# EAGLE design MainController (EAGLE 9.6.2)
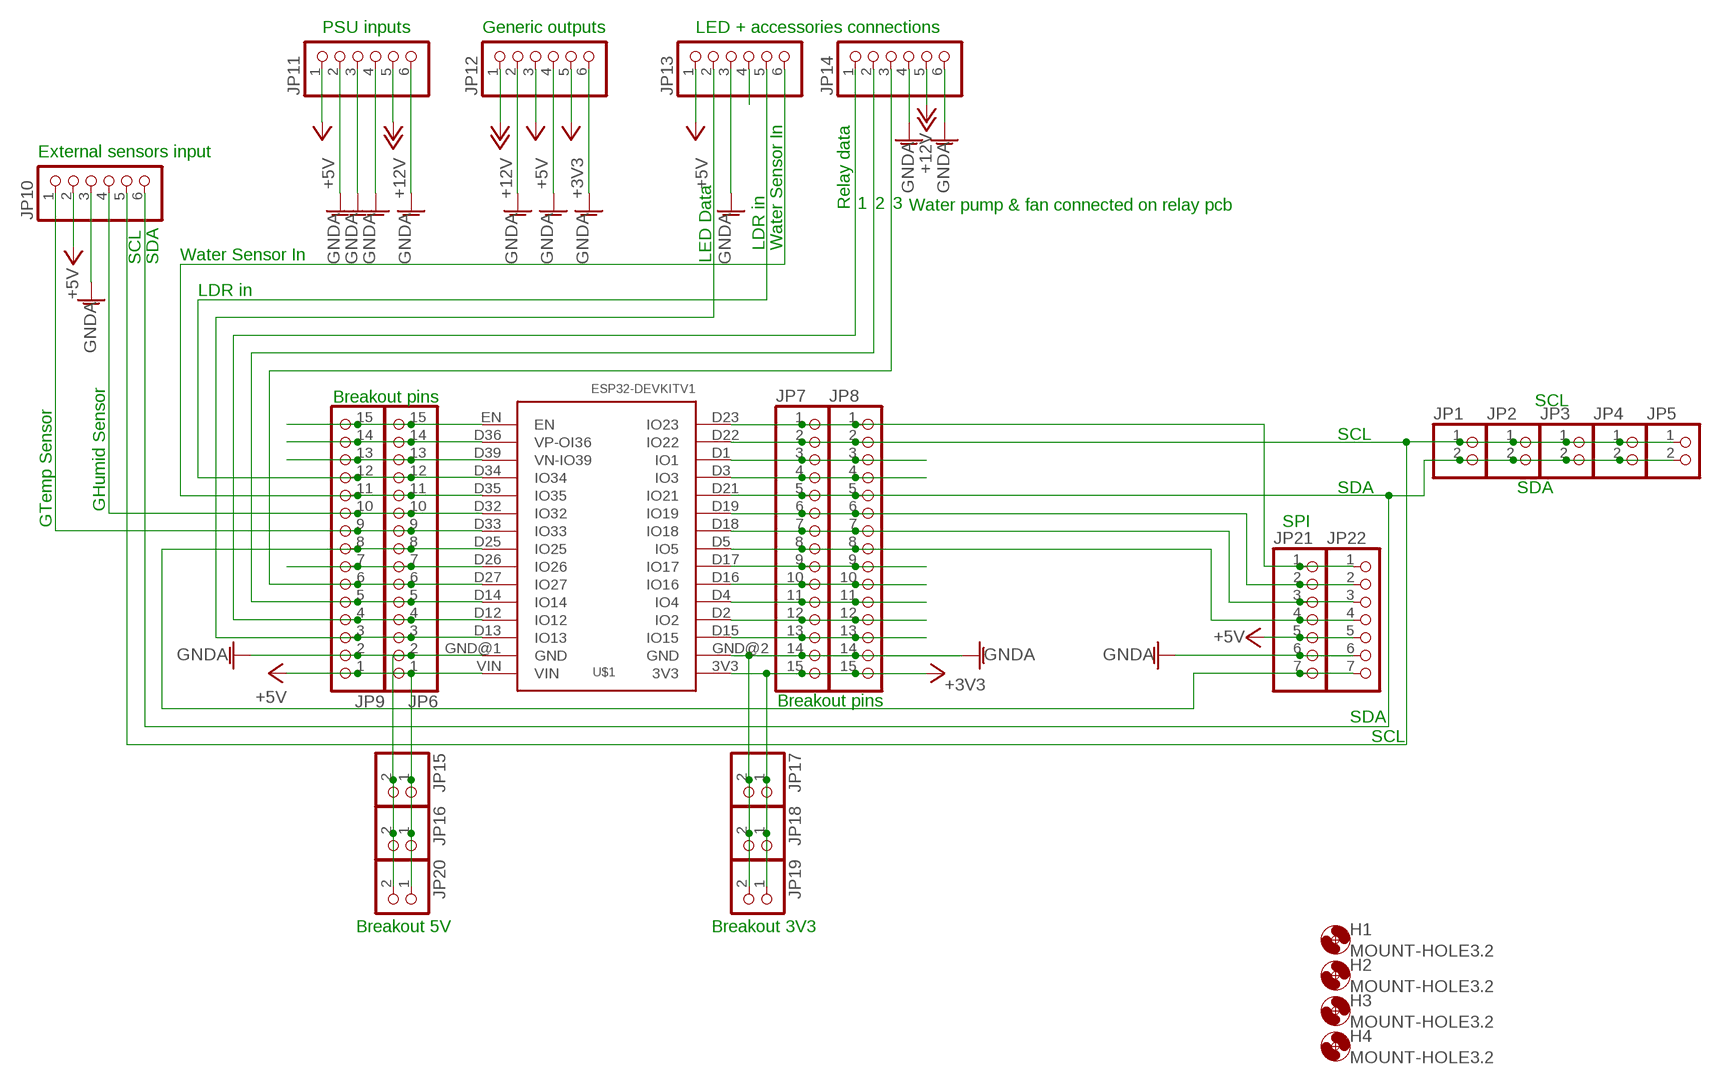
[diagram p0: schematic, sheet 1]

## Parts
H1  MOUNT-HOLE3.2  [3,2]
H2  MOUNT-HOLE3.2  [3,2]
H3  MOUNT-HOLE3.2  [3,2]
H4  MOUNT-HOLE3.2  [3,2]
JP1  PINHD-1X2  [1X02]
JP2  PINHD-1X2  [1X02]
JP3  PINHD-1X2  [1X02]
JP4  PINHD-1X2  [1X02]
JP5  PINHD-1X2  [1X02]
JP6  PINHD-1X15  [1X15]
JP7  PINHD-1X15  [1X15]
JP8  PINHD-1X15  [1X15]
JP9  PINHD-1X15  [1X15]
JP10  PINHD-1X6  [1X06]
JP11  PINHD-1X6  [1X06]
JP12  PINHD-1X6  [1X06]
JP13  PINHD-1X6  [1X06]
JP14  PINHD-1X6  [1X06]
JP15  PINHD-1X2  [1X02]
JP16  PINHD-1X2  [1X02]
JP17  PINHD-1X2  [1X02]
JP18  PINHD-1X2  [1X02]
JP19  PINHD-1X2  [1X02]
JP20  PINHD-1X2  [1X02]
JP21  PINHD-1X7  [1X07]
JP22  PINHD-1X7  [1X07]
U$1  ESP32DEVKITV1  [ESP32-DEVKITV1]

## Nets
+3V3: JP7.15 JP8.15 JP12.5 JP17.1 JP18.1 JP19.1 U$1.3V3
+5V: JP6.1 JP9.1 JP10.2 JP11.1 JP12.3 JP13.1 JP15.1 JP16.1 JP20.1 JP21.5 JP22.5 U$1.VIN
+12V: JP11.5 JP12.1 JP14.5
GNDA: JP6.2 JP7.14 JP8.14 JP9.2 JP10.3 JP11.2 JP11.3 JP11.4 JP11.6 JP12.2 JP12.4 JP12.6 JP13.3 JP14.4 JP14.6 JP15.2 JP16.2 JP17.2 JP18.2 JP19.2 JP20.2 JP21.6 JP22.6 U$1.GND@1(GND) U$1.GND@2(GND)
N$1: JP6.10 JP9.10 JP10.4 U$1.D32(IO32)
N$2: JP6.9 JP9.9 JP10.1 U$1.D33(IO33)
N$3: JP7.9 JP8.9 U$1.D17(IO17)
N$4: JP6.7 JP9.7 U$1.D26(IO26)
N$6: JP7.6 JP8.6 JP21.2 JP22.2 U$1.D19(IO19)
N$7: JP7.1 JP8.1 JP21.1 JP22.1 U$1.D23(IO23)
N$8: JP6.13 JP9.13 U$1.D39(VN-IO39)
N$9: JP6.14 JP9.14 U$1.D36(VP-OI36)
N$10: JP6.15 JP9.15 U$1.EN
N$14: JP1.1 JP2.1 JP3.1 JP4.1 JP5.1 JP7.2 JP8.2 JP10.5 U$1.D22(IO22)
N$15: JP13.4
N$16: JP6.3 JP9.3 JP13.2 U$1.D13(IO13)
N$17: JP6.12 JP9.12 JP13.5 U$1.D34(IO34)
N$18: JP7.3 JP8.3 U$1.D1(IO1)
N$19: JP7.4 JP8.4 U$1.D3(IO3)
N$20: JP1.2 JP2.2 JP3.2 JP4.2 JP5.2 JP7.5 JP8.5 JP10.6 U$1.D21(IO21)
N$21: JP6.4 JP9.4 JP14.1 U$1.D12(IO12)
N$22: JP6.5 JP9.5 JP14.2 U$1.D14(IO14)
N$23: JP7.8 JP8.8 JP21.4 JP22.4 U$1.D5(IO5)
N$24: JP7.10 JP8.10 U$1.D16(IO16)
N$26: JP7.11 JP8.11 U$1.D4(IO4)
N$27: JP7.12 JP8.12 U$1.D2(IO2)
N$28: JP7.13 JP8.13 U$1.D15(IO15)
N$29: JP6.11 JP9.11 JP13.6 U$1.D35(IO35)
N$34: JP6.8 JP9.8 JP21.7 JP22.7 U$1.D25(IO25)
N$35: JP7.7 JP8.7 JP21.3 JP22.3 U$1.D18(IO18)
N$36: JP6.6 JP9.6 JP14.3 U$1.D27(IO27)

## Notes on the sheet
- PSU inputs | Generic outputs | LED + accessories connections
- External sensors input
- Relay data | 1 | 2 | 3 | Water pump & fan connected on relay pcb
- LDR in | Water Sensor In
- SCL | SDA | Water Sensor In | LED Data
- LDR in
- Breakout pins | SCL
- SCL
- SDA | SDA
- GHumid Sensor
- GTemp Sensor | SPI
- Breakout pins
- SDA
- SCL
- Breakout 5V | Breakout 3V3

## Library data of the parts
H1-H4 = holes:MOUNT-HOLE: MOUNTING HOLE with drill center marker
JP1-JP5 JP15-JP20 = pinhead:PINHD-1X2: PIN HEADER
JP6-JP9 = pinhead:PINHD-1X15: PIN HEADER
JP10-JP14 = pinhead:PINHD-1X6: PIN HEADER
JP21 JP22 = pinhead:PINHD-1X7: PIN HEADER
U$1 = ESP32-DEVKITV1:ESP32DEVKITV1

## Board
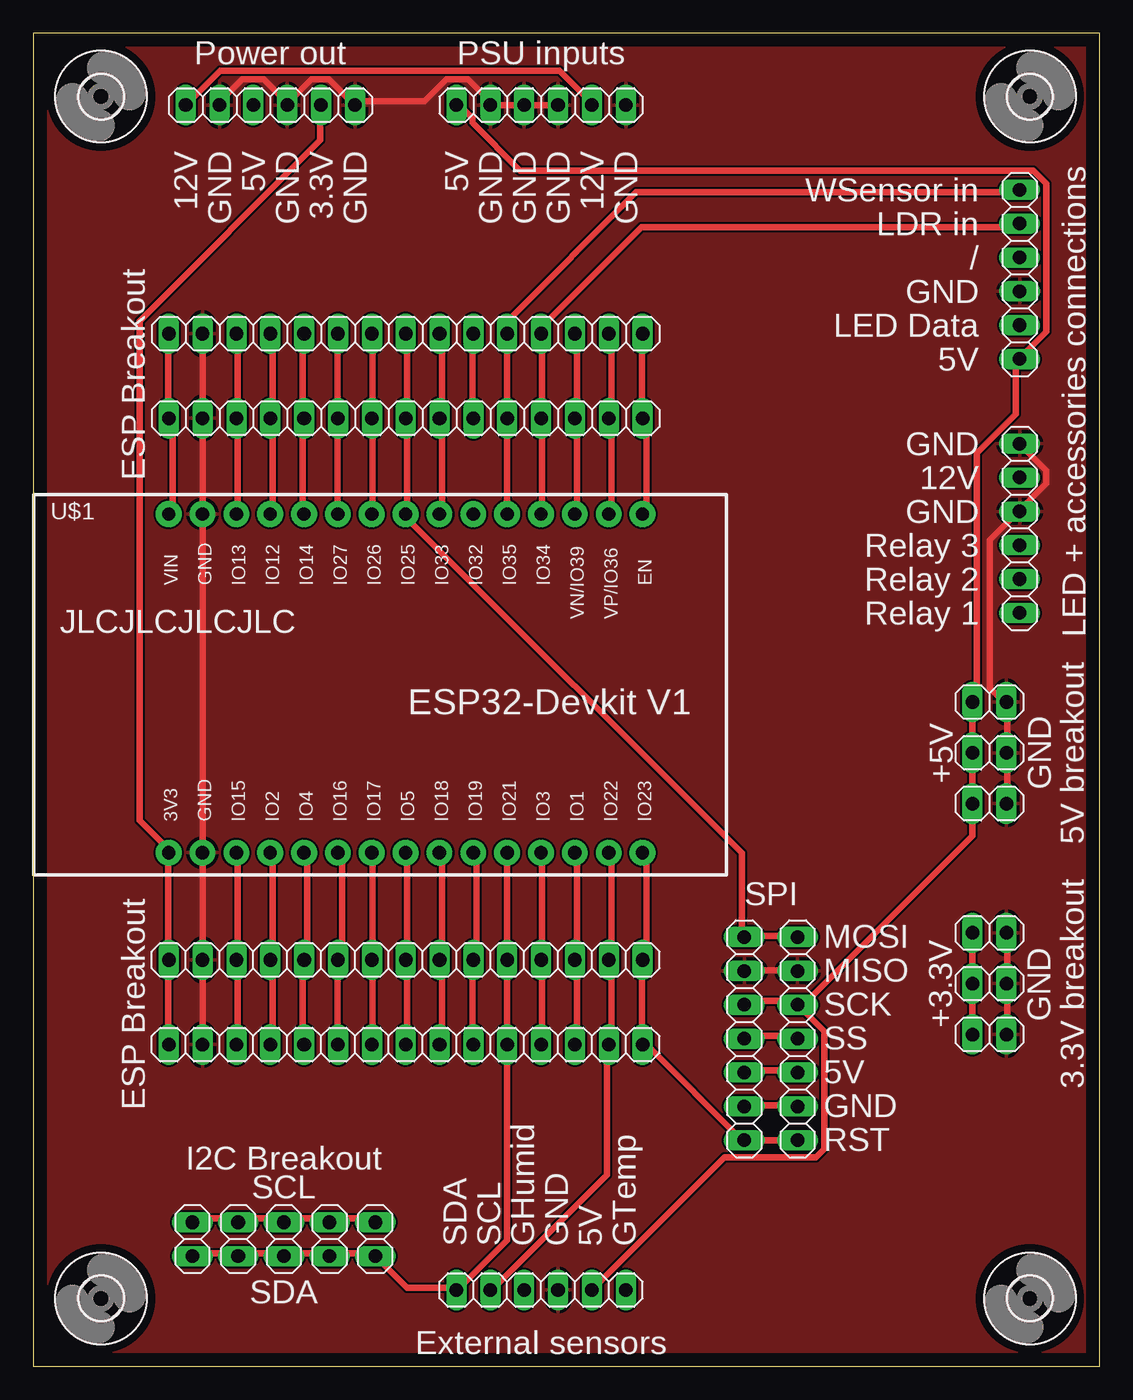
[diagram p1: board, top side]
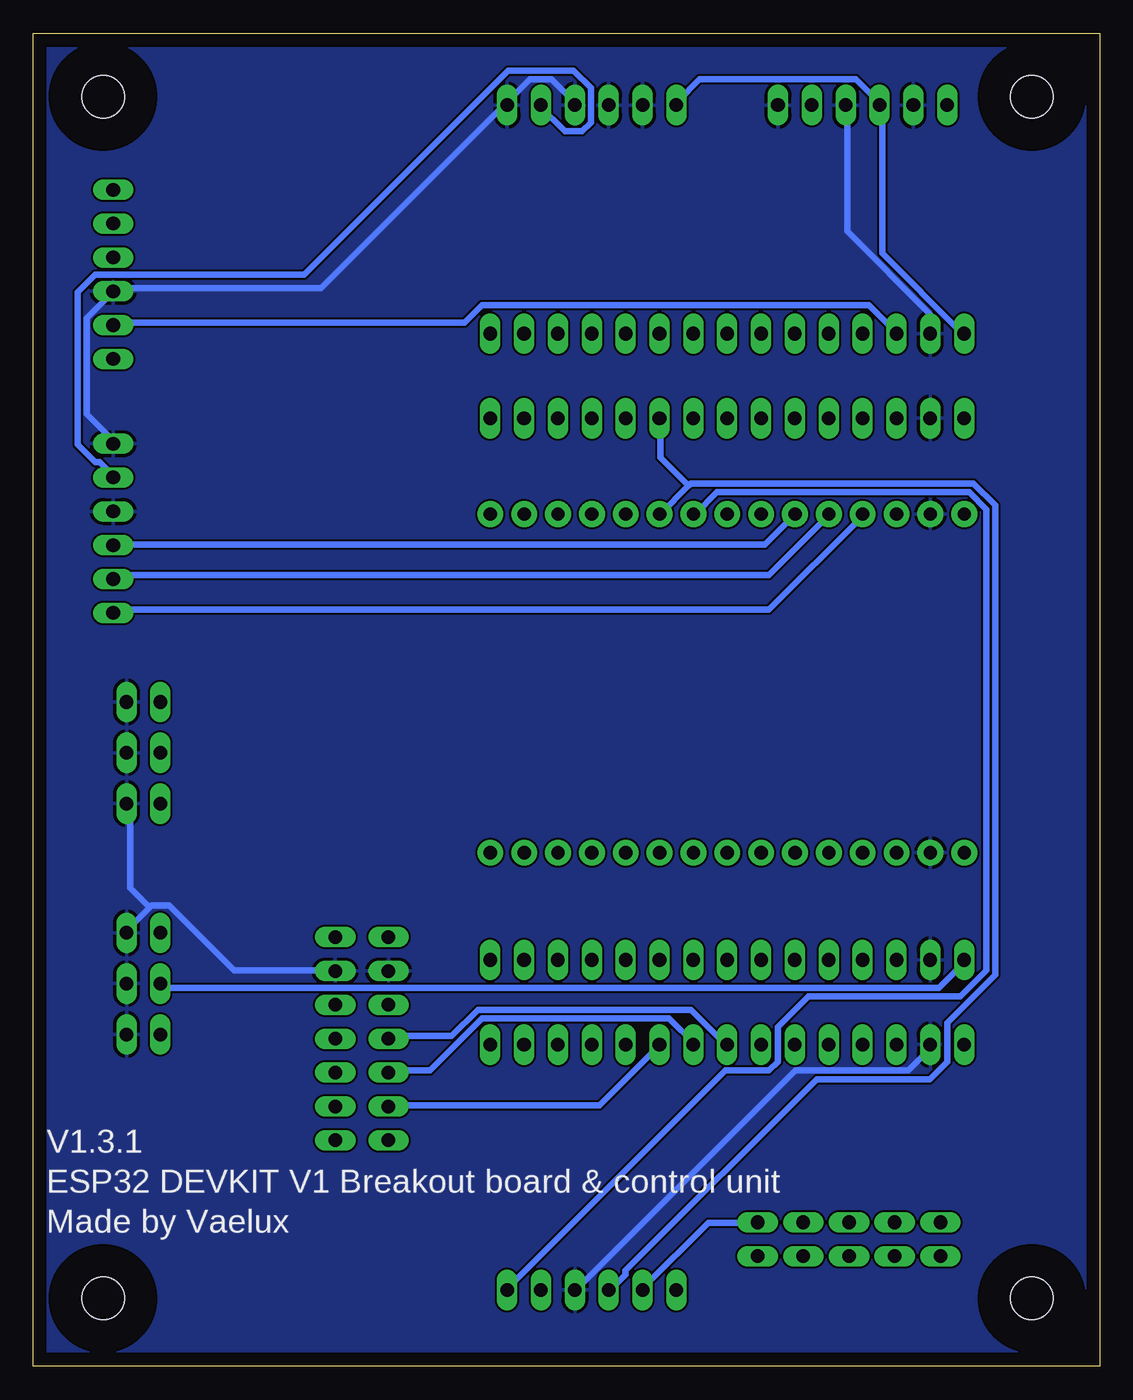
[diagram p2: board, bottom side, seen from below]

Size 80 x 100 mm. Coordinates in mm from the lower left corner, seen from the top.
Outline: 0,0 80,0 80,100 0,100 0,0
Copper layers (1*16): Top 0.035mm / dielectric 1.5mm / Bottom 0.035mm
Design rules "default *": minimum track width 0.5mm, minimum drill 0.35mm, track to track 6mil, track to pad 6mil, pad to pad 6mil, via to via 6mil, smd to smd 6mil, copper to edge 40mil, drill to drill 6mil, minimum pad ring 10mil, minimum via ring 8mil, stop-mask expansion 4mil, vias tented up to drill 0mil, thermal gap 10mil

### Footprints (pad centres in the part's own frame; a part is rotated, then mirrored left to right if it is on the bottom)
3,2 = hole 3.2: 0,0
1X02 = drill 1.016 long: 1 -1.27,0; 2 1.27,0
1X15 = drill 1.016 long: 1 -17.78,0; 2 -15.24,0; 3 -12.7,0; 4 -10.16,0; 5 -7.62,0; 6 -5.08,0; 7 -2.54,0; 8 0,0; 9 2.54,0; 10 5.08,0; 11 7.62,0; 12 10.16,0; 13 12.7,0; 14 15.24,0; 15 17.78,0
1X06 = drill 1.016 long: 1 -6.35,0; 2 -3.81,0; 3 -1.27,0; 4 1.27,0; 5 3.81,0; 6 6.35,0
1X07 = drill 1.016 long: 1 -7.62,0; 2 -5.08,0; 3 -2.54,0; 4 0,0; 5 2.54,0; 6 5.08,0; 7 7.62,0
ESP32-DEVKITV1 = drill 1 pad 1.93: 3V3 -16.52,-12.27; D1 13.96,-12.27; D2 -8.9,-12.27; D3 11.42,-12.27; D4 -6.36,-12.27; D5 1.26,-12.27; D12 -8.9,13.135; D13 -11.44,13.135; D14 -6.36,13.135; D15 -11.44,-12.27; D16 -3.82,-12.27; D17 -1.28,-12.27; D18 3.8,-12.27; D19 6.34,-12.27; D21 8.88,-12.27; D22 16.5,-12.27; D23 19.04,-12.27; D25 1.26,13.135; D26 -1.28,13.135; D27 -3.82,13.135; D32 6.34,13.135; D33 3.8,13.135; D34 11.42,13.135; D35 8.88,13.135; D36 16.5,13.135; D39 13.96,13.135; EN 19.04,13.135; GND@1 -13.98,13.135; GND@2 -13.98,-12.27; VIN -16.52,13.135

### Placement (x,y rotation side)
H1  5.08,5.08 0 top
H2  5.08,95.25 0 top
H3  74.77,5.08 0 top
H4  74.77,95.25 0 top
JP1  11.94,9.53 270 top
JP2  15.37,9.53 270 top
JP3  18.8,9.53 270 top
JP4  22.23,9.53 270 top
JP5  25.65,9.53 270 top
JP6  27.94,71.12 0 top
JP7  27.94,30.48 180 top
JP8  27.94,24.13 180 top
JP9  27.94,77.47 0 top
JP10  38.1,5.71 180 top
JP11  38.1,94.61 0 top
JP12  17.78,94.61 0 top
JP13  74.01,81.92 90 top
JP14  74.01,62.87 90 top
JP15  71.74,42.21 0 top
JP16  71.74,46.02 0 top
JP17  71.74,24.89 0 top
JP18  71.74,28.7 0 top
JP19  71.74,32.51 0 top
JP20  71.74,49.83 0 top
JP21  53.35,24.57 90 top
JP22  57.35,24.57 90 top
U$1  26.67,50.8 0 top

### Tracks (layer width: path | path; a pad name or v marks a point on that pad's centre or on a via)
+3V3
  Top 0.5: JP17.1 70.46,25.12 70.46,28.38 JP18.1 70.46,32.29 JP19.1 | JP8.15 10.11,24.14 10.11,30.34 JP7.15 10.11,30.66 10.11,38.49 U$1.3V3 10.11,38.82 7.97,40.96 7.97,78.42 21.53,91.97 21.53,94.6 JP12.5
  Bottom 0.5: JP18.1 70.46,28.38 12.07,28.38 10.11,30.34 JP7.15
+5V
  Top 0.5: JP9.1 10.11,77.31 10.11,71.44 JP6.1 10.44,71.11 10.44,63.94 U$1.VIN | JP10.2 42.08,5.87 51.87,15.66 58.72,15.66 59.37,16.31 59.37,25.12 57.41,27.07 JP22.5 | JP21.5 53.5,27.4 57.09,27.4 JP22.5 | JP22.5 57.74,27.07 70.46,39.8 70.46,42.08 JP15.1 70.46,42.41 70.46,45.99 JP16.1 70.46,46.32 70.46,49.58 JP20.1 70.78,49.91 70.78,68.5 73.72,71.44 73.72,75.35 JP13.1 74.05,75.68 76,77.64 76,88.73 75.03,89.7 36.53,89.7 32.95,93.29 32.95,93.62 31.97,94.6 JP11.1
  Bottom 0.5: JP11.1 31.64,94.92 30.01,96.56 18.27,96.56 16.64,94.92 JP12.3 16.31,94.6 16.31,83.51 10.44,77.64 JP9.1
+12V
  Top 0.5: JP12.1 11.74,94.92 14.03,97.21 39.47,97.21 41.75,94.92 JP11.5
  Bottom 0.5: JP14.5 74.05,66.87 75.03,67.85 75.35,67.85 76.66,69.15 76.66,80.57 75.35,81.88 59.7,81.88 44.36,97.21 39.47,97.21 38.16,95.9 38.16,93.29 38.82,92.64 40.12,92.64 42.08,94.6 JP11.5
GNDA
  Top 0.5: JP14.6 74.05,69.15 76,67.2 76,66.22 74.05,64.26 JP14.4 73.72,63.94 71.76,61.98 71.76,50.89 72.74,49.91 JP20.2 73.07,49.58 73.07,46.32 JP16.2 73.07,45.99 73.07,42.41 JP15.2 | JP21.6 53.5,29.68 57.09,29.68 JP22.6 | JP17.2 73.07,25.12 73.07,28.38 JP18.2 73.07,28.71 73.07,32.29 JP19.2 | JP8.14 12.72,24.14 12.72,30.34 JP7.14 12.72,30.66 12.72,38.49 U$1.GND@2 12.72,38.82 12.72,63.61 U$1.GND@1 12.72,63.94 12.72,71.11 JP6.2 12.72,71.44 12.72,77.31 JP9.2 | JP12.2 14.03,94.92 15.66,96.56 17.29,96.56 18.92,94.92 JP12.4 19.25,94.92 20.88,96.56 22.18,96.56 23.81,94.92 JP12.6 24.14,94.92 29.36,94.92 30.99,96.56 32.62,96.56 34.25,94.92 JP11.2 34.58,94.6 36.53,94.6 JP11.3 36.86,94.6 39.14,94.6 JP11.4
  Bottom 0.5: JP14.6 74.05,69.48 76,71.44 76,78.61 74.05,80.57 JP13.3 73.72,80.9 58.39,80.9 44.69,94.6 JP11.6 44.36,94.92 42.73,96.56 41.1,96.56 39.47,94.92 JP11.4 | 71.28,34.41 73.07,32.62 JP19.2 | 71.28,34.41 71.11,34.58 69.81,34.58 64.91,29.68 57.41,29.68 JP22.6 | 71.28,34.41 72.74,35.88 72.74,42.08 JP15.2 | JP10.3 39.14,5.87 22.83,22.18 14.35,22.18 12.72,23.81 JP8.14 | JP9.2 12.72,77.64 12.72,78.94 18.92,85.14 18.92,94.6 JP12.4
  pour Top: 0,100 79,100 80,100 80,0 0,0
  pour Bottom: 0,100 80,100 80,0 0,0
N$1
  Top 0.5: JP6.10 32.95,71.44 32.95,77.31 JP9.10
  Bottom 0.5: 30.83,66.06 32.95,63.94 U$1.D32 | 30.83,66.06 30.66,66.22 9.46,66.22 7.83,64.59 7.83,29.36 11.42,25.77 11.42,22.83 12.72,21.53 21.2,21.53 35.56,7.18 35.56,6.85 36.53,5.87 JP10.4 | 30.83,66.06 32.95,68.18 32.95,71.11 JP6.10
N$2
  Top 0.5: JP9.9 30.66,77.31 30.66,71.44 JP6.9 30.66,71.11 30.66,63.94 U$1.D33
  Bottom 0.5: JP10.1 44.36,5.87 28.05,22.18 24.79,22.18 24.14,22.83 24.14,25.44 21.86,27.73 10.44,27.73 8.48,29.68 8.48,64.26 9.79,65.57 28.71,65.57 30.34,63.94 U$1.D33
N$3
  Top 0.5: JP8.9 25.44,24.14 25.44,30.34 JP7.9 25.44,30.66 25.44,38.49 U$1.D17
N$4
  Top 0.5: JP9.7 25.44,77.31 25.44,71.44 JP6.7 25.44,71.11 25.44,63.94 U$1.D26
N$6
  Top 0.5: JP21.2 53.5,19.57 57.09,19.57 JP22.2 | JP8.6 32.95,24.14 32.95,30.34 JP7.6 33.27,30.66 33.27,38.49 U$1.D19
  Bottom 0.5: JP21.2 53.17,19.57 37.51,19.57 33.27,23.81 JP8.6
N$7
  Top 0.5: JP22.1 57.09,16.96 53.5,16.96 JP21.1 53.17,16.96 45.99,24.14 JP8.1 45.67,24.14 45.67,30.34 JP7.1 45.99,30.66 45.99,38.49 U$1.D23
N$8
  Top 0.5: JP9.13 40.77,77.31 40.77,71.44 JP6.13 40.77,71.11 40.77,63.94 U$1.D39
N$9
  Top 0.5: JP9.14 43.38,77.31 43.38,71.44 JP6.14 43.38,71.11 43.38,63.94 U$1.D36
N$10
  Top 0.5: JP9.15 45.67,77.31 45.67,71.44 JP6.15 45.99,71.11 45.99,63.94 U$1.EN
N$14
  Top 0.5: U$1.D22 43.38,38.49 43.38,30.66 JP7.2 43.38,30.34 43.38,24.14 JP8.2 43.06,23.81 43.06,14.35 34.58,5.87 JP10.5 | JP1.1 12.07,11.09 15.33,11.09 JP2.1 15.66,11.09 18.59,11.09 JP3.1 18.92,11.09 22.18,11.09 JP4.1 22.51,11.09 25.44,11.09 JP5.1
  Bottom 0.5: JP10.5 34.25,5.87 29.36,10.77 25.77,10.77 JP5.1
N$16
  Top 0.5: JP9.3 15.33,77.31 15.33,71.44 JP6.3 15.33,71.11 15.33,63.94 U$1.D13
  Bottom 0.5: JP13.2 73.72,78.29 47.62,78.29 46.32,79.59 17.29,79.59 15.33,77.64 JP9.3
N$17
  Top 0.5: JP13.5 73.72,85.46 45.61,85.46 38.41,78.27 JP9.12 38.16,77.31 38.16,71.44 JP6.12 38.16,71.11 38.16,63.94 U$1.D34
N$18
  Top 0.5: JP8.3 40.77,24.14 40.77,30.34 JP7.3 40.77,30.66 40.77,38.49 U$1.D1
N$19
  Top 0.5: JP8.4 38.16,24.14 38.16,30.34 JP7.4 38.16,30.66 38.16,38.49 U$1.D3
N$20
  Top 0.5: U$1.D21 35.56,38.49 35.56,30.66 JP7.5 35.56,30.34 JP8.5 35.56,23.81 35.56,9.46 31.97,5.87 JP10.6 31.64,5.87 28.05,5.87 25.77,8.15 JP5.2 25.44,8.48 22.51,8.48 JP4.2 22.18,8.48 18.92,8.48 JP3.2 18.59,8.48 15.66,8.48 JP2.2 15.33,8.48 12.07,8.48 JP1.2
N$21
  Top 0.5: JP9.4 17.94,77.31 17.94,71.44 JP6.4 17.94,71.11 17.94,63.94 U$1.D12
  Bottom 0.5: JP14.1 73.72,56.76 24.79,56.76 17.94,63.61 U$1.D12
N$22
  Top 0.5: JP9.5 20.22,77.31 20.22,71.44 JP6.5 20.22,71.11 20.22,63.94 U$1.D14
  Bottom 0.5: JP14.2 73.72,59.37 24.79,59.37 20.55,63.61 U$1.D14
N$23
  Top 0.5: JP21.4 53.5,24.79 57.09,24.79 JP22.4 | JP8.8 28.05,24.14 28.05,30.34 JP7.8 28.05,30.66 28.05,38.49 U$1.D5
  Bottom 0.5: JP21.4 53.17,24.79 48.6,24.79 46.65,26.75 30.66,26.75 28.05,24.14 JP8.8
N$24
  Top 0.5: JP8.10 22.83,24.14 22.83,30.34 JP7.10 23.16,30.66 23.16,38.49 U$1.D16
N$26
  Top 0.5: JP8.11 20.22,24.14 20.22,30.34 JP7.11 20.55,30.66 20.55,38.49 U$1.D4
N$27
  Top 0.5: JP8.12 17.94,24.14 17.94,30.34 JP7.12 17.94,30.66 17.94,38.49 U$1.D2
N$28
  Top 0.5: JP8.13 15.33,24.14 15.33,30.34 JP7.13 15.33,30.66 15.33,38.49 U$1.D15
N$29
  Top 0.5: JP13.6 73.72,88.07 45.23,88.07 35.54,78.38 JP9.11 35.56,77.31 35.56,71.44 JP6.11 U$1.D35
N$34
  Top 0.5: JP22.7 57.09,32.29 53.5,32.29 JP21.7 53.17,32.29 53.17,38.49 28.05,63.61 U$1.D25 28.05,63.94 28.05,71.11 JP6.8 28.05,71.44 28.05,77.31 JP9.8
N$35
  Top 0.5: JP21.3 53.5,22.18 57.09,22.18 JP22.3 | JP8.7 30.66,24.14 30.66,30.34 JP7.7 30.66,30.66 30.66,38.49 U$1.D18
  Bottom 0.5: JP21.3 53.17,22.18 50.23,22.18 46.32,26.1 32.29,26.1 30.34,24.14 JP8.7
N$36
  Top 0.5: JP9.6 22.83,77.31 22.83,71.44 JP6.6 22.83,71.11 22.83,63.94 U$1.D27
  Bottom 0.5: JP14.3 73.72,61.65 25.12,61.65 23.16,63.61 U$1.D27

### Text on the board
tPlace: Power out | PSU inputs | 12V | GND | 5V | GND | 3.3V | GND | 5V | GND | GND | GND | 12V | GND | WSensor in | LDR in | / | GND | LED Data | 5V | ESP Breakout | LED + accessories connections | GND | 12V | GND | Relay 3 | Relay 2 | Relay 1 | JLCJLCJLCJLC | +5V | GND | 5V breakout | SPI | MOSI | MISO | +3.3V | GND | 3.3V breakout | ESP Breakout | SCK | SS | 5V | GND | RST | I2C Breakout | SCL | SDA | SCL | GHumid | GND | 5V | GTemp | SDA | External sensors
bPlace: V1.3.1 | ESP32 DEVKIT V1 Breakout board & control unit | Made by Vaelux